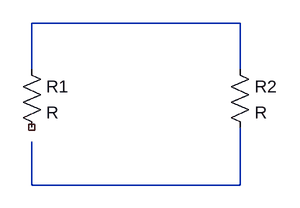
[diagram p0: schematic input.asc]
input.asc, the LTspice schematic file:
Version 4
SHEET 1 2068 1956
WIRE 48 -32 -240 -32
WIRE -240 32 -240 -32
WIRE 48 32 48 -32
WIRE -240 192 -240 132
WIRE 48 192 48 112
WIRE 48 192 -240 192
SYMBOL res -256 16 R0
SYMATTR InstName R1
SYMBOL res 32 16 R0
SYMATTR InstName R2

The netlist it stands for:
* input.asc
R1 N001 NC_01 R
R2 N001 N002 R
.backanno
.end